# EAGLE schematic zumy carrier board (EAGLE 6.5.0)
AUTHOR: A.Pullin / A.J.Chen; REVISION: C; YEAR: 2014
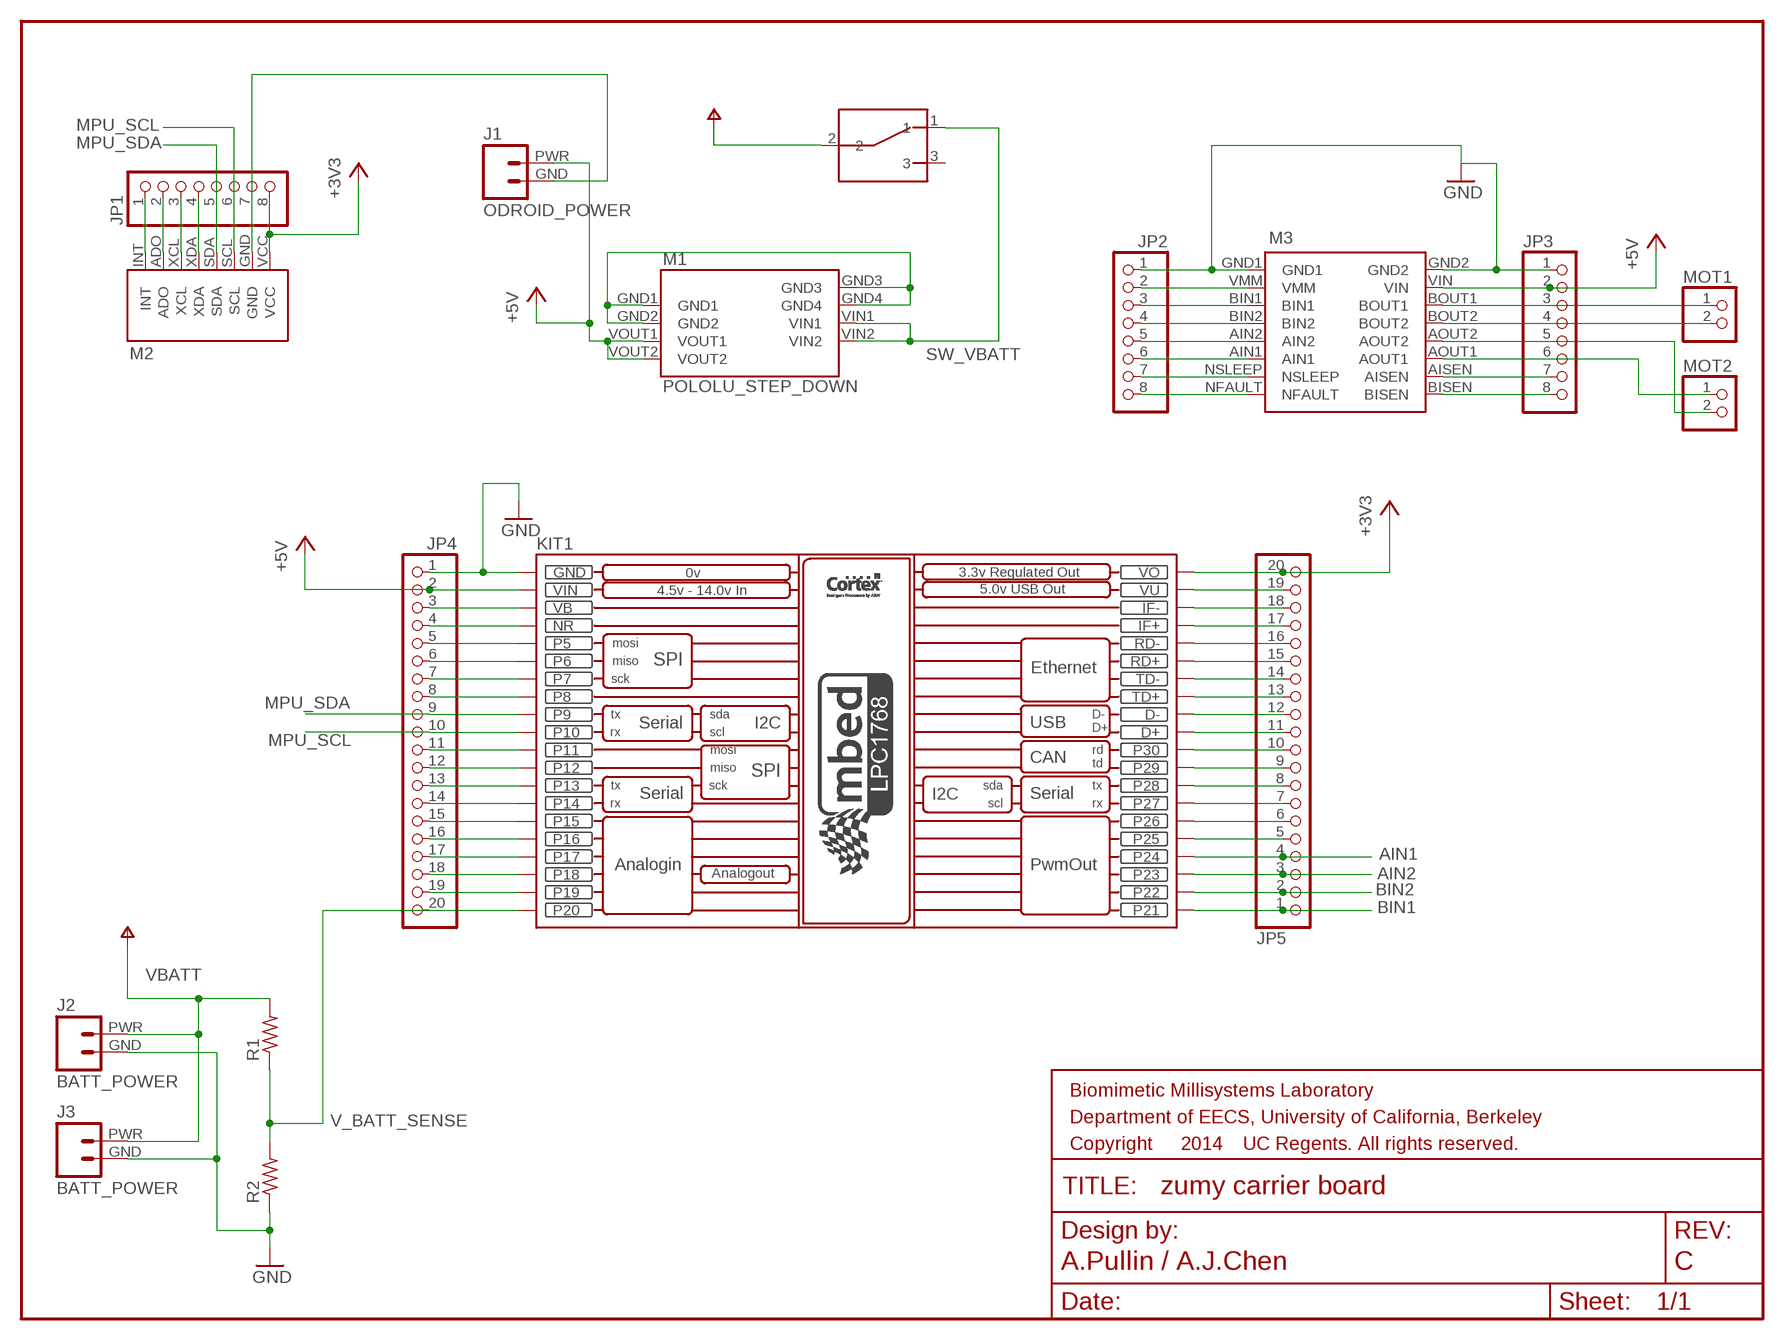
[diagram p0: schematic, sheet 1]

## Parts
J1  ODROID_POWER  [ODOIRD_PWR]
J2  BATT_POWER  [BATT_POWER]
J3  BATT_POWER  [BATT_POWER]
JP1  PINHD-1X8  [1X08]
JP2  PINHD-1X8  [1X08]
JP3  PINHD-1X8  [1X08]
JP4  PINHD-1X20  [1X20]
JP5  PINHD-1X20  [1X20]
KIT1  MBED_NXP_LPC1768  [MBED-KIT]
M1  POLOLU_STEP_DOWN  [POLOLU_STEP_DOWN]
M2  ITG/MPU_MODULE  [ITG/MPU_MODULE]
M3  POLOLU_DRV8833_MODULE  [POLOLU_DRV8833_MODULE]
MOT1  PINHD-1X2  [1X02]
MOT2  PINHD-1X2  [1X02]
R1  R-US_0204/5  [0204/5]
R2  R-US_0204/5  [0204/5]
SW1  500SSP1S1M6QEA  [500SSP1S1M6QEA_SWITCH]

## Nets
+3V3: JP1.8 JP5.20 KIT1.VOUT(VO) M2.VCC
+5V: J1.PWR JP3.2 JP4.2 KIT1.VIN M1.VOUT1 M1.VOUT2 M3.VIN
AIN1: JP2.6 JP5.4 KIT1.P$24(P24) M3.AIN1
AIN2: JP2.5 JP5.3 KIT1.P$23(P23) M3.AIN2
BIN1: JP2.3 JP5.1 KIT1.P$21(P21) M3.BIN1
BIN2: JP2.4 JP5.2 KIT1.P$22(P22) M3.BIN2
GND: J2.GND J3.GND JP2.1 JP3.1 JP4.1 KIT1.GND M3.GND1 M3.GND2 R2.1
MPU_SCL: JP1.6 JP4.10 KIT1.P$10(P10) M2.SCL
MPU_SDA: JP1.5 JP4.9 KIT1.P$9(P9) M2.SDA
N$1: JP1.1 M2.INT
N$2: JP1.2 M2.ADO
N$3: JP1.3 M2.XCL
N$4: JP1.4 M2.XDA
N$5: J1.GND JP1.7 M2.GND
N$10: JP4.15 KIT1.P$15(P15)
N$11: JP4.3 KIT1.VB
N$12: JP4.4 KIT1.NR
N$13: JP4.5 KIT1.P$5(P5)
N$14: JP4.6 KIT1.P$6(P6)
N$15: JP4.7 KIT1.P$7(P7)
N$16: JP4.8 KIT1.P$8(P8)
N$19: JP4.11 KIT1.P$11(P11)
N$20: JP4.12 KIT1.P$12(P12)
N$21: JP4.13 KIT1.P$13(P13)
N$22: JP4.14 KIT1.P$14(P14)
N$24: JP4.16 KIT1.P$16(P16)
N$25: JP4.17 KIT1.P$17(P17)
N$26: JP4.18 KIT1.P$18(P18)
N$27: JP4.19 KIT1.P$19(P19)
N$33: JP5.5 KIT1.P$25(P25)
N$34: JP5.6 KIT1.P$26(P26)
N$35: JP5.7 KIT1.P$27(P27)
N$36: JP5.8 KIT1.P$28(P28)
N$37: JP5.9 KIT1.P$29(P29)
N$38: JP5.10 KIT1.P$30(P30)
N$39: JP5.11 KIT1.D+
N$40: JP5.12 KIT1.D-
N$41: JP5.13 KIT1.TD+
N$42: JP5.14 KIT1.TD-
N$43: JP5.15 KIT1.RD+
N$44: JP5.16 KIT1.RD-
N$45: JP5.17 KIT1.IF+
N$46: JP5.18 KIT1.IF-
N$47: JP5.19 KIT1.VU
N$50: JP2.2 M3.VMM
N$55: JP2.7 M3.NSLEEP
N$56: JP2.8 M3.NFAULT
N$59: JP3.3 M3.BOUT1 MOT1.1
N$60: JP3.4 M3.BOUT2 MOT1.2
N$61: JP3.5 M3.AOUT2 MOT2.2
N$62: JP3.6 M3.AOUT1 MOT2.1
N$63: JP3.7 M3.AISEN
N$64: JP3.8 M3.BISEN
N$65: M1.GND1 M1.GND2 M1.GND3 M1.GND4
SW_VBATT: M1.VIN1 M1.VIN2 SW1.1
V_BATT_SENSE: JP4.20 KIT1.P$20(P20) R1.1 R2.2
VBATT: J2.PWR J3.PWR R1.2 SW1.2 ; supply symbol labelled V+
Unconnected: SW1.3

## Library data of the parts
J1 = zumy:ODROID_POWER
J2 J3 = zumy:BATT_POWER
JP1-JP3 = zumy:PINHD-1X8: PIN HEADER
JP4 JP5 = zumy:PINHD-1X20: PIN HEADER
KIT1 = zumy:MBED_NXP_LPC1768: Mbed LPC1768 - ARM CORTEX v2.1 * Schematic symbol is now placed in eagles's default raster. *The pads diameter are suitable for routing between mbed pins * mbed pads are 0.8 mm drill diameter. --------------------------------------------- Created by: Mohamed Yousry *Alexandria, Egypt *Email: mohamed.yousry@ieeegoldegypt.org
M1 = zumy:POLOLU_STEP_DOWN
M2 = zumy:ITG/MPU_MODULE
M3 = zumy:POLOLU_DRV8833_MODULE
MOT1 MOT2 = pinhead:PINHD-1X2: PIN HEADER
R1 R2 = resistor:R-US_: RESISTOR, American symbol
SW1 = zumy:500SSP1S1M6QEA